# Altium schematic sheet CAN&MicroSDD&IO_Expandor.SchDoc
size A4; Revision: B.2(PCB.SCH)
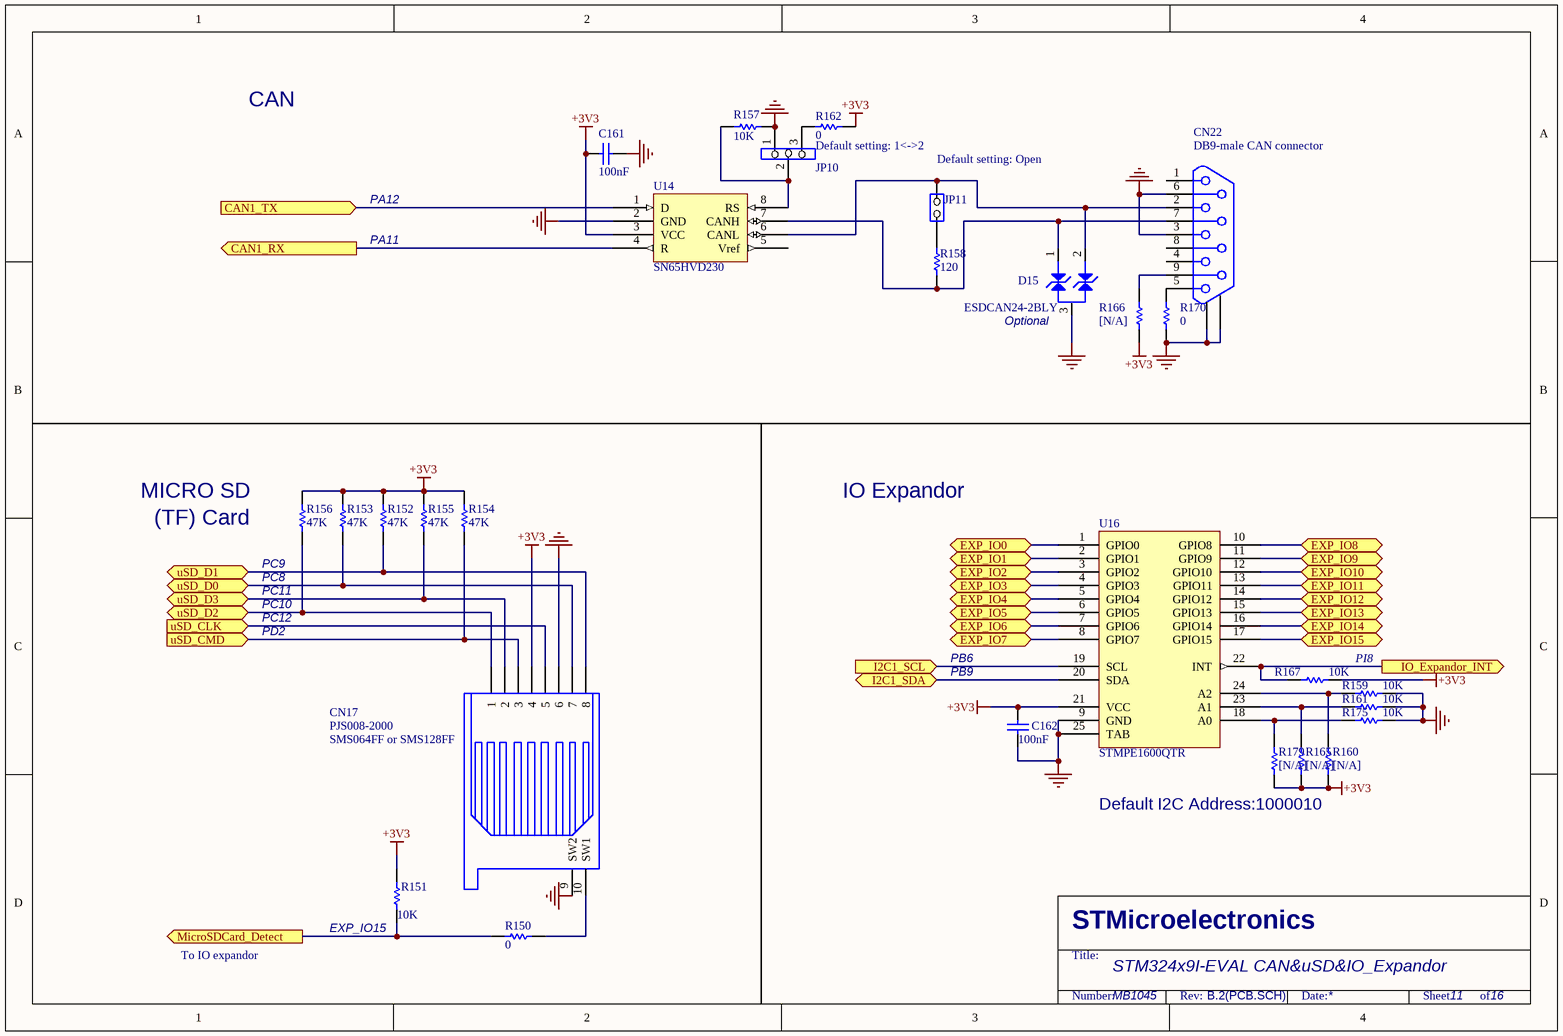
[diagram p0: CAN&MicroSDD&IO_Expandor.SchDoc]

## Parts
C161  100nF  [0603C]
C162  100nF  [0603C]
CN17  PJS008-2000  [MSD_PJS008_]
CN22  DB9-male CAN connector  [DB9/M]
D15  ESDCAN24-2BLY  [SOT23-213]
JP10  (no value)  [SIP3]
JP11  (no value)  [SIP2]
R150  0  [0603R]
R151  10K  [0603R]
R152  47K  [0603R]
R153  47K  [0603R]
R154  47K  [0603R]
R155  47K  [0603R]
R156  47K  [0603R]
R157  10K  [0603R]
R158  120  [0603R]
R159  10K  [0603R]
R160  [N/A]  [0603R]
R161  10K  [0603R]
R162  0  [0603R]
R165  [N/A]  [0603R]
R166  [N/A]  [0603R]
R167  10K  [0603R]
R170  0  [0603R]
R175  10K  [0603R]
R179  [N/A]  [0603R]
U14  SN65HVD230  [SOIC8_1R27_4R9X6]
U16  STMPE1600QTR  [QFN24_0R5_4X4]

## Ports
CAN1_RX (out), CAN1_TX (in), EXP_IO0 (bidir), EXP_IO1 (bidir), EXP_IO2 (bidir), EXP_IO3 (bidir), EXP_IO4 (bidir), EXP_IO5 (bidir), EXP_IO6 (bidir), EXP_IO7 (bidir), EXP_IO8 (bidir), EXP_IO9 (bidir), EXP_IO10 (bidir), EXP_IO11 (bidir), EXP_IO12 (bidir), EXP_IO13 (bidir), EXP_IO14 (bidir), EXP_IO15 (bidir), I2C1_SCL (in), I2C1_SDA (bidir), IO_Expandor_INT (out), MicroSDCard_Detect (out), uSD_CLK (in), uSD_CMD (in), uSD_D0 (bidir), uSD_D1 (bidir), uSD_D2 (bidir), uSD_D3 (bidir)

## Nets
+3V3: C161.1 C162.1 CN17.4 R151.2 R152.1 R153.1 R154.1 R155.1 R156.1 R160.1 R162.2 R165.1 R166.1 R167.1 R179.1 U14.3(VCC) U16.21(VCC)
GND: C161.2 C162.2 CN17.6 CN17.9(SW2) CN22.3 CN22.6 CN22.10 CN22.11 D15.3 JP10.1 R157.2 R159.1 R161.1 R170.1 R175.1 U14.2(GND) U16.9(GND) U16.25(TAB)
CAN1_RX: U14.4(R) ; port CAN1_RX
CAN1_TX: U14.1(D) ; port CAN1_TX
EXP_IO0: U16.1(GPIO0) ; port EXP_IO0
EXP_IO1: U16.2(GPIO1) ; port EXP_IO1
EXP_IO2: U16.3(GPIO2) ; port EXP_IO2
EXP_IO3: U16.4(GPIO3) ; port EXP_IO3
EXP_IO4: U16.5(GPIO4) ; port EXP_IO4
EXP_IO5: U16.6(GPIO5) ; port EXP_IO5
EXP_IO6: U16.7(GPIO6) ; port EXP_IO6
EXP_IO7: U16.8(GPIO7) ; port EXP_IO7
EXP_IO8: U16.10(GPIO8) ; port EXP_IO8
EXP_IO9: U16.11(GPIO9) ; port EXP_IO9
EXP_IO10: U16.12(GPIO10) ; port EXP_IO10
EXP_IO11: U16.13(GPIO11) ; port EXP_IO11
EXP_IO12: U16.14(GPIO12) ; port EXP_IO12
EXP_IO13: U16.15(GPIO13) ; port EXP_IO13
EXP_IO14: U16.16(GPIO14) ; port EXP_IO14
EXP_IO15: U16.17(GPIO15) ; port EXP_IO15
I2C1_SCL: U16.19(SCL) ; port I2C1_SCL
I2C1_SDA: U16.20(SDA) ; port I2C1_SDA
IO_Expandor_INT: R167.2 U16.22(INT) ; port IO_Expandor_INT
MicroSDCard_Detect: R150.1 R151.1 ; port MicroSDCard_Detect
uSD_CLK: CN17.5 ; port uSD_CLK
uSD_CMD: CN17.3 R154.2 ; port uSD_CMD
uSD_D0: CN17.7 R153.2 ; port uSD_D0
uSD_D1: CN17.8 R152.2 ; port uSD_D1
uSD_D2: CN17.1 R156.2 ; port uSD_D2
uSD_D3: CN17.2 R155.2 ; port uSD_D3
NetCN17_10: CN17.10(SW1) R150.2
NetCN22_2: CN22.2 D15.2 JP11.2(NO) U14.6(CANL)
NetCN22_5: CN22.5 R170.2
NetCN22_7: CN22.7 D15.1 R158.1 U14.7(CANH)
NetCN22_9: CN22.9 R166.2
NetJP10_2: JP10.2 R157.1 U14.8(RS)
NetJP10_3: JP10.3 R162.1
NetJP11_1: JP11.1(COMMON) R158.2
NetR159_2: R159.2 R160.2 U16.24(A2)
NetR161_2: R161.2 R165.2 U16.23(A1)
NetR175_2: R175.2 R179.2 U16.18(A0)

Not connected (* = marked no-connect by the designer): CN22 1 4 8; U14 5(Vref)

## Notes on the sheet
- CAN
- Default setting: 1<->2
- (near JP11) Default setting: Open
- PA12
- PA11
- (near D15) Optional
- MICRO SD
- IO Expandor
- (near R156) (TF) Card
- (near R156) PC8
- (near R156) PC9
- PC10
- PC11
- PC12
- PD2
- PB9
- PB6
- PI8
- (near CN17) SMS064FF or SMS128FF
- Default I2C Address:1000010
- To IO expandor
- (near R151) EXP_IO15
- STM324x9I-EVAL CAN&uSD&IO_Expandor
- MB1045
- 11
- 16
- STMicroelectronics
- Title:
- Number:
- Rev:
- Date:
- Sheet          of

## Library data of the parts
C161 C162 = Cap: Capacitor; Value: 10nF; Published: 8-Jun-2000; Revision: July-2002: Re-released for DXP Platform.; Publisher: Altium Limited
CN17 = SMS016AFA5E
CN22 = DB9-CAN
JP10 = Jumper3
JP11 = JP2
R150 R151 R157 R160 R165 R167 R179 = Res1: Resistor; Value: 1K; Published: 8-Jun-2000; Revision: July-2002: Re-released for DXP Platform.; Publisher: Altium Limited
R152-R156 R158 R159 R161 R162 R166 R170 R175 = res1: Resistor; Value: 1K; Published: 8-Jun-2000; Revision: July-2002: Re-released for DXP Platform.; Publisher: Altium Limited
U14 = SN65HVD230D
U16 = STMPE1600